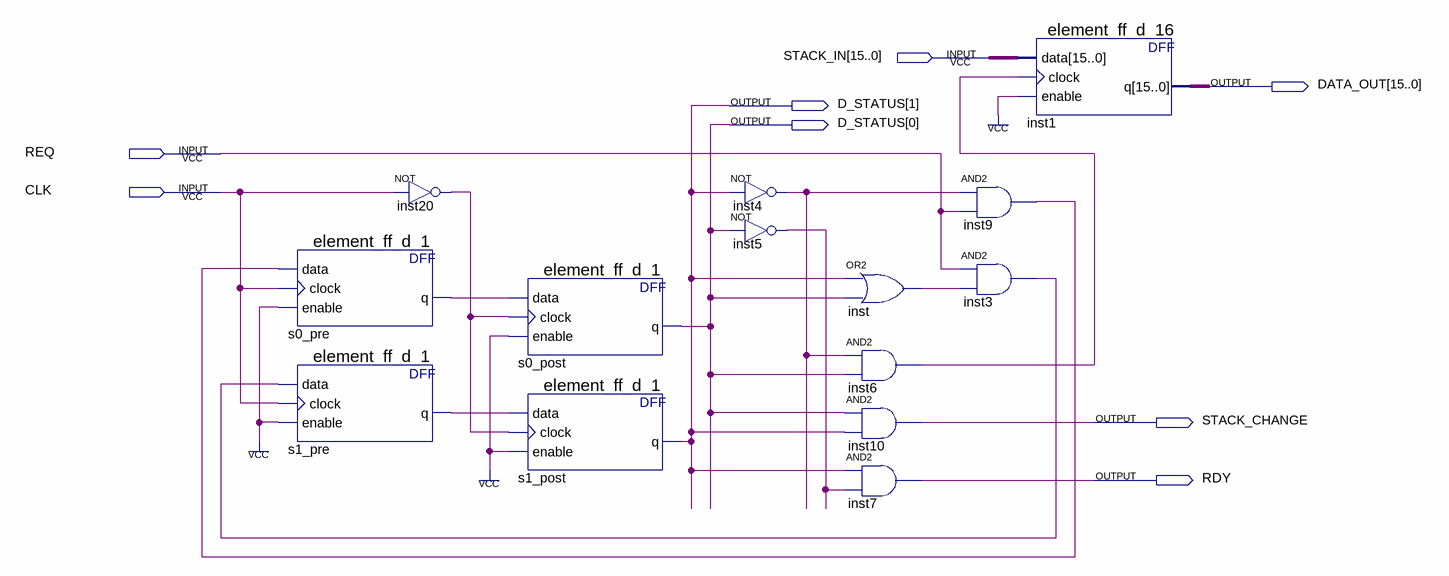
[diagram p0: schematic sheet]
// Quartus schematic block-writer-variant-stack-pop.bdf as structural Verilog: 14 symbols, 8 pins
module \block-writer-variant-stack-pop  (
  input  [15:0] STACK_IN,
  input  REQ,
  input  CLK,
  output [15:0] DATA_OUT,
  output [1:0] D_STATUS,
  output STACK_CHANGE,
  output RDY
);

  wire inst3_out, inst4_out, inst5_out, inst6_out, inst9_out, inst20_out, inst_out, s0_pre_q, s1_pre_q;

  element_ff_d_1 s0_pre (.data(inst9_out), .clock(CLK), .enable(1'b1), .q(s0_pre_q));
  element_ff_d_1 s1_pre (.data(inst3_out), .clock(CLK), .enable(1'b1), .q(s1_pre_q));
  not inst20 (inst20_out, CLK);
  element_ff_d_1 s0_post (.data(s0_pre_q), .clock(inst20_out), .enable(1'b1), .q(D_STATUS[0]));
  element_ff_d_1 s1_post (.data(s1_pre_q), .clock(inst20_out), .enable(1'b1), .q(D_STATUS[1]));
  not inst4 (inst4_out, D_STATUS[1]);
  not inst5 (inst5_out, D_STATUS[0]);
  or inst (inst_out, D_STATUS[1], D_STATUS[0]);
  and inst6 (inst6_out, inst4_out, D_STATUS[0]);
  and inst10 (STACK_CHANGE, D_STATUS[0], D_STATUS[1]);
  and inst7 (RDY, D_STATUS[1], inst5_out);
  and inst9 (inst9_out, inst4_out, REQ);
  and inst3 (inst3_out, REQ, inst_out);
  element_ff_d_16 inst1 (.data(STACK_IN), .clock(inst6_out), .enable(1'b1), .q(DATA_OUT));
endmodule
